# EAGLE schematic Ventilation (EAGLE 6.5.0)
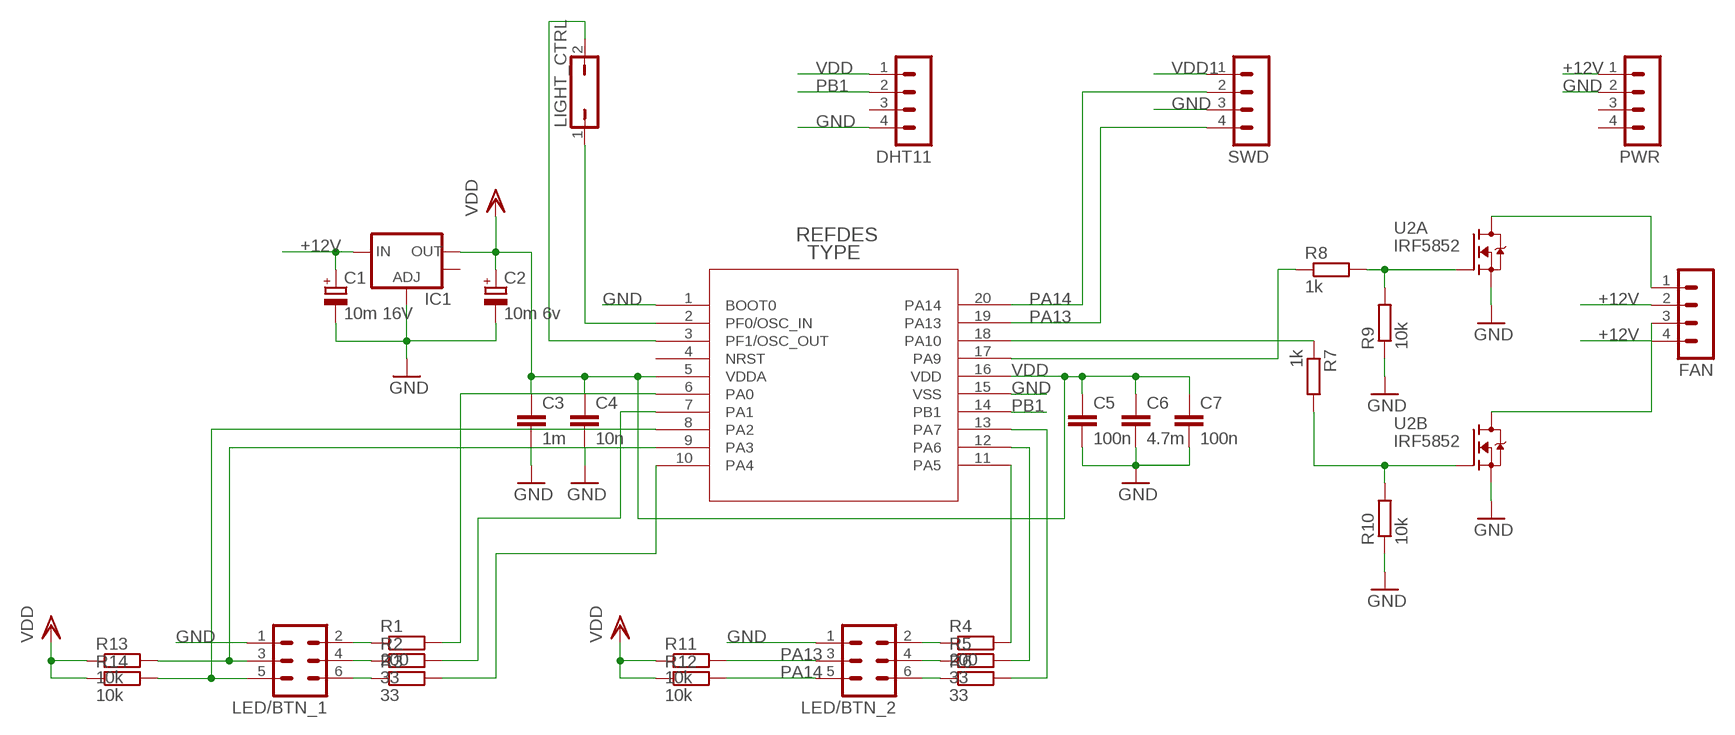
[diagram p0: schematic, sheet 1]

## Parts
C1  10m 16V  CPOL-EUSMCA  [SMC_A]
C2  10m 6v  CPOL-EUSMCA  [SMC_A]
C3  1m  C-EUC1206  [C1206]
C4  10n  C-EUC1206  [C1206]
C5  100n  C-EUC1206  [C1206]
C6  4.7m  C-EUC1206  [C1206]
C7  100n  C-EUC1206  [C1206]
DHT11  MA04-1  [MA04-1]
FAN  MA04-1  [MA04-1]
IC1  V_REG_LM1117SOT223  [SOT223]
LED/BTN_1  MA03-2  [MA03-2]
LED/BTN_2  MA03-2  [MA03-2]
LIGHT_CTRL  JP1Q  [JP1]
PWR  MA04-1  [MA04-1]
R1  200  R-EU_R1206  [R1206]
R2  33  R-EU_R1206  [R1206]
R3  33  R-EU_R1206  [R1206]
R4  200  R-EU_R1206  [R1206]
R5  33  R-EU_R1206  [R1206]
R6  33  R-EU_R1206  [R1206]
R7  1k  R-EU_R1206  [R1206]
R8  1k  R-EU_R1206  [R1206]
R9  10k  R-EU_R1206  [R1206]
R10  10k  R-EU_R1206  [R1206]
R11  10k  R-EU_R1206  [R1206]
R12  10k  R-EU_R1206  [R1206]
R13  10k  R-EU_R1206  [R1206]
R14  10k  R-EU_R1206  [R1206]
SWD  MA04-1  [MA04-1]
U2  IRF5852  [SOT23-6]
U$1  STM32F050F4P6  [TSSOP20]

## Nets
+12V: C1.+ FAN.2 FAN.4 IC1.3(IN) PWR.1
GND: C1.- C2.- C3.2 C4.2 C5.2 C6.2 C7.2 DHT11.4 IC1.1(ADJ) LED/BTN_1.1 LED/BTN_2.1 PWR.2 R9.1 R10.1 SWD.3 U2.2(B:S) U2.5(A:S) U$1.1(BOOT0) U$1.15(VSS)
N$1: R8.1 U$1.17(PA9)
N$2: R7.2 R10.2 U2.3(B:G)
N$3: FAN.1 U2.6(A:D)
N$4: FAN.3 U2.4(B:D)
N$5: R7.1 U$1.18(PA10)
N$6: R8.2 R9.2 U2.1(A:G)
N$7: R1.2 U$1.6(PA0)
N$8: LIGHT_CTRL.1 U$1.2(PF0/OSC_IN)
N$9: LIGHT_CTRL.2 U$1.3(PF1/OSC_OUT)
N$10: R2.2 U$1.7(PA1)
N$12: LED/BTN_1.3 R13.2 U$1.9(PA3)
N$13: LED/BTN_1.5 R14.2 U$1.8(PA2)
N$14: LED/BTN_2.2 R4.1
N$15: LED/BTN_2.4 R5.1
N$16: LED/BTN_2.6 R6.1
N$17: LED/BTN_1.2 R1.1
N$18: LED/BTN_1.4 R2.1
N$19: LED/BTN_1.6 R3.1
N$20: R5.2 U$1.12(PA6)
N$21: R6.2 U$1.13(PA7)
N$22: R4.2 U$1.11(PA5)
N$23: R3.2 U$1.10(PA4)
PA13: LED/BTN_2.3 R11.2 SWD.4 U$1.19(PA13)
PA14: LED/BTN_2.5 R12.2 SWD.2 U$1.20(PA14)
PB1: DHT11.2 U$1.14(PB1)
VDD: C2.+ C3.1 C4.1 C5.1 C6.1 C7.1 DHT11.1 IC1.2(OUT) R11.1 R12.1 R13.1 R14.1 U$1.5(VDDA) U$1.16(VDD)
VDD1: SWD.1
Unconnected: DHT11.3 IC1.4(OUT) PWR.3 PWR.4 U$1.4(NRST)

## Library data of the parts
C1 C2 = rcl:CPOL-EU: POLARIZED CAPACITOR, European symbol
C3-C7 = resistor:C-EU: CAPACITOR, European symbol
DHT11 FAN PWR SWD = con-lstb:MA04-1: PIN HEADER; OC_FARNELL: unknown; OC_NEWARK: unknown
IC1 = SparkFun-PowerIC:V_REG_LM1117: Voltage Regulator LM1117 Standard adjustable voltage regulator but in SMD form. Spark Fun Electronics SKU : COM-00595
LED/BTN_1 LED/BTN_2 = con-lstb:MA03-2: PIN HEADER; OC_FARNELL: unknown; OC_NEWARK: unknown
LIGHT_CTRL = jumper:JP1Q: JUMPER
R1-R14 = resistor:R-EU_: RESISTOR, European symbol
U2 = transistor-fet:IRF5852
U$1 = STM32F0:STM32F050F4P6: STM32F050F4P6